# EAGLE design untitled (EAGLE 8.3.2)
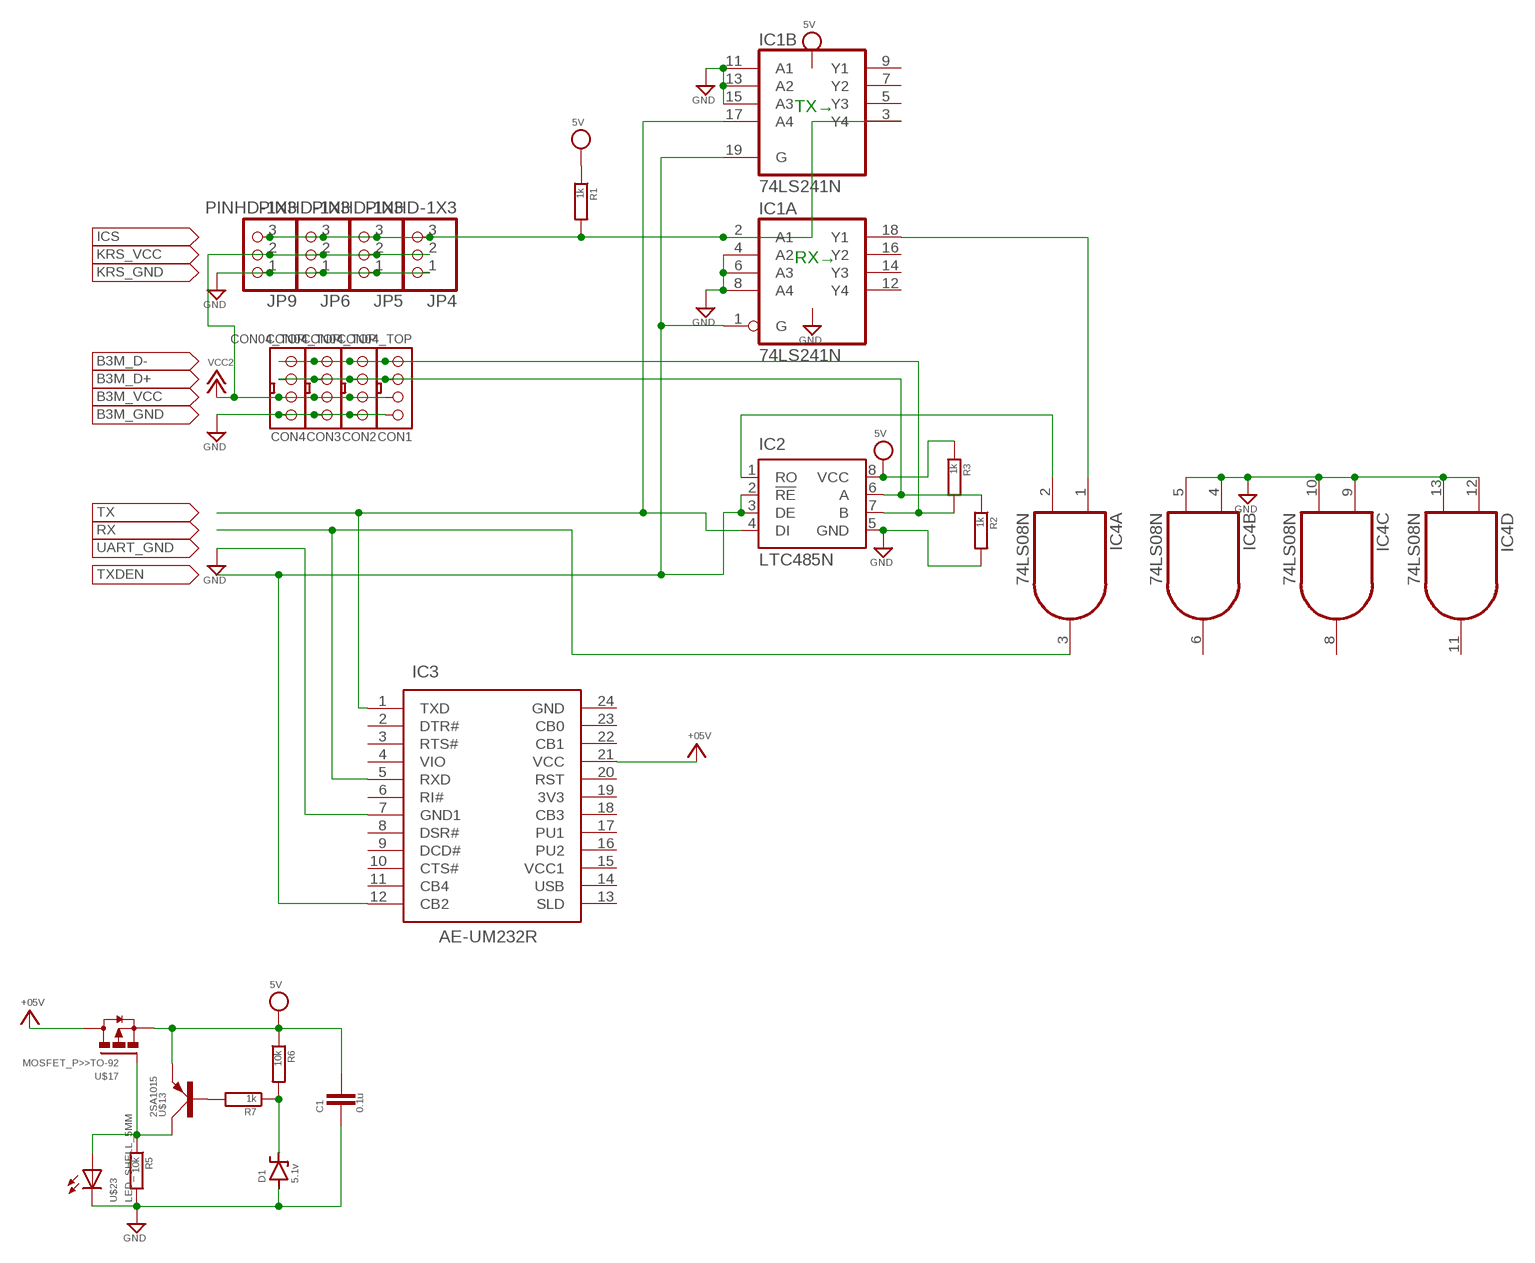
[diagram p0: schematic, sheet 1]

## Parts
C1  0.1u  C>>050-024X044  [C050-024X044]
CON1  CON04_TOP  [TOP_CON4]
CON2  CON04_TOP  [TOP_CON4]
CON3  CON04_TOP  [TOP_CON4]
CON4  CON04_TOP  [TOP_CON4]
D1  5.1v  ZENER-DIODE>>ZD-5  [ZDIO-5]
IC1  74LS241N  [DIL20]
IC2  LTC485N  [DIL08]
IC3  AE-UM232R  [AE-UM232R]
IC4  74LS08N  [DIL14]
JP4  PINHD-1X3  [1X03]
JP5  PINHD-1X3  [1X03]
JP6  PINHD-1X3  [1X03]
JP9  PINHD-1X3  [1X03]
R1  1k  R-EU>>1/4W(8MM)  [1/4W(8MM)]
R2  1k  R-EU>>1/4W(8MM)  [1/4W(8MM)]
R3  1k  R-EU>>1/4W(8MM)  [1/4W(8MM)]
R5  10k  R-EU>>1/4W(8MM)  [1/4W(8MM)]
R6  10k  R-EU>>1/4W(8MM)  [1/4W(8MM)]
R7  1k  R-EU>>1/4W(8MM)  [1/4W(8MM)]
U$13  2SA1015  TR_PNP>>TO-92  [TO-92]
U$17  MOSFET_P>>TO-92  [TO-92]
U$23  LED_SHELL_5MM  [5MM]

## Nets
+5V: IC3.21(VCC) U$17.2(D) ; supply symbol labelled +05V
GND: C1.2 CON1.P$1 CON2.P$1 CON3.P$1 CON4.P$1 D1.A IC1.4(A:A2) IC1.6(A:A3) IC1.8(A:A4) IC1.11(B:A1) IC1.13(B:A2) IC1.15(B:A3) IC2.5(GND) IC3.7(GND1) IC4.4(B:I0) IC4.5(B:I1) IC4.9(C:I0) IC4.10(C:I1) IC4.12(D:I0) IC4.13(D:I1) JP4.1 JP5.1 JP6.1 JP9.1 R2.2 R5.2 U$23.P$2(C)
ICS: IC1.2(A:A1) IC1.3(B:Y4) JP4.3 JP5.3 JP6.3 JP9.3 R1.2
N$1: IC1.18(A:Y1) IC4.1(A:I0)
N$5: CON1.P$3 CON2.P$3 CON3.P$3 CON4.P$3 IC2.6(A) R2.1
N$7: IC2.1(RO) IC4.2(A:I1)
N$9: R5.1 U$13.2(C) U$17.1(G) U$23.P$1(A)
N$10: D1.C R6.2 R7.1
N$11: R7.2 U$13.3(B)
N$12: CON1.P$4 CON2.P$4 CON3.P$4 CON4.P$4 IC2.7(B) R3.2
RXD: IC3.5(RXD) IC4.3(A:O)
TXD: IC1.17(B:A4) IC2.4(DI) IC3.1(TXD)
TXDEN: IC1.1(A:G) IC1.19(B:G) IC2.2(!RE) IC2.3(DE) IC3.12(CB2)
VCC: C1.1 IC2.8(VCC) R1.1 R3.1 R6.1 U$13.1(E) U$17.3(S) ; supply symbol labelled 5V
VCC2: CON1.P$2 CON2.P$2 CON3.P$2 CON4.P$2 JP4.2 JP5.2 JP6.2 JP9.2
Unconnected: IC1.5(B:Y3) IC1.7(B:Y2) IC1.9(B:Y1) IC1.12(A:Y4) IC1.14(A:Y3) IC1.16(A:Y2) IC3.2(DTR#) IC3.3(RTS#) IC3.4(VIO) IC3.6(RI#) IC3.8(DSR#) IC3.9(DCD#) IC3.10(CTS#) IC3.11(CB4) IC3.13(SLD) IC3.14(USB) IC3.16(PU2) IC3.17(PU1) IC3.18(CB3) IC3.19(3V3) IC3.20(RST) IC3.22(CB1) IC3.23(CB0) IC4.6(B:O) IC4.8(C:O) IC4.11(D:O)

## Notes on the sheet
- TX→
- RX→

## Power pins joined to a net without a drawn wire
GND: IC1.10(P:GND) IC3.24(GND) IC4.7(P:GND)
VCC: IC1.20(P:VCC) IC4.14(P:VCC)
VCC1: IC3.15(VCC1)

## Library data of the parts
C1 = !Capasiter:C>>: CAPACITOR, European symbol
CON1-CON4 = !con_XH(XHｺﾈｸﾀ):CON04_: Low insertion connector 4pin
D1 = !diode(ﾀﾞｲｵｰﾄﾞ):ZENER-DIODE>>: Z-Diode
IC1 = 74xx-us:74*241: Octal BUFFER and LINE DRIVER, 3-state
IC2 = linear-technology:LTC485: Low Power RS485 Interface Transceiver Source: http://www.linear.com/pc/downloadDocument.do?navId=H0,C1,C1007,C1017,P2064,D1718; OC_FARNELL: unknown; OC_NEWARK: unknown
IC3 = !usb-usart:AE-UM232R: FT232RL USB-Serial Converter - AE-UM232R
IC4 = 74xx-us:74*08: Quad 2-input AND gate
JP4-JP6 JP9 = !pinhead(ﾋﾟﾝﾍｯﾀﾞ):PINHD-1X3: PIN HEADER
R1-R3 R5-R7 = !Resistor(抵抗):R-EU>>: RESISTOR, European symbol
U$13 = !FET_transister_v-reg:TR_PNP>>
U$17 = !FET_transister_v-reg:MOSFET_P>>
U$23 = !led:LED_SHELL

## Board
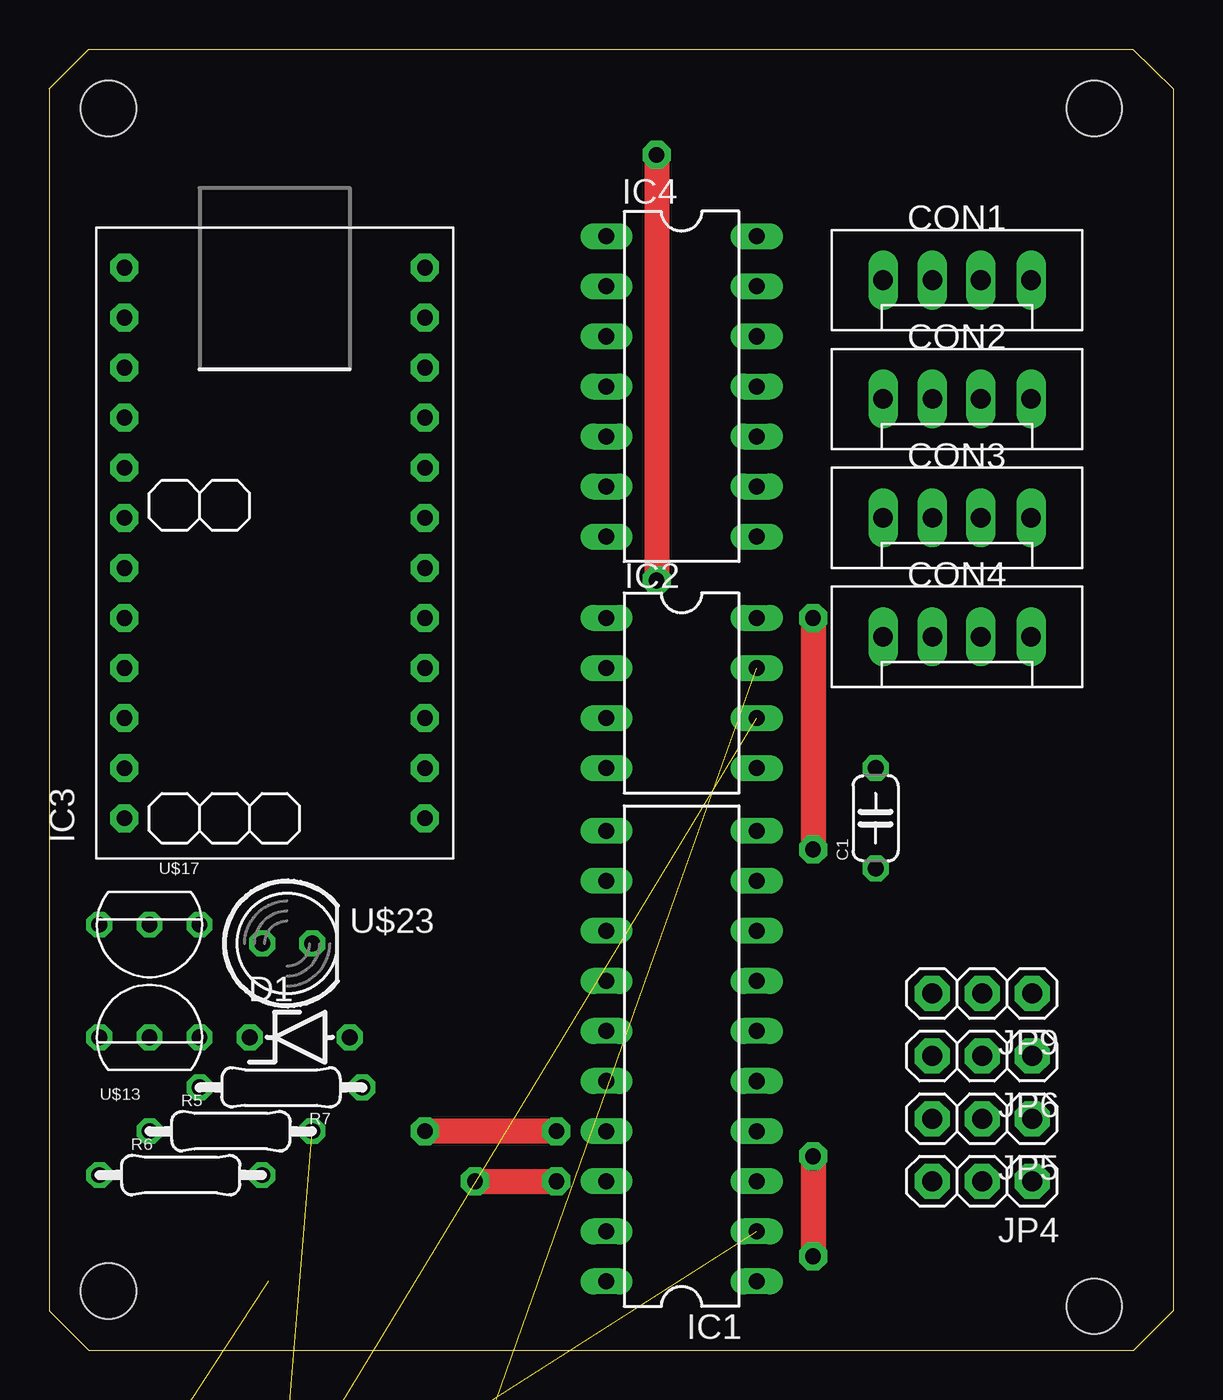
[diagram p1: board, top side]
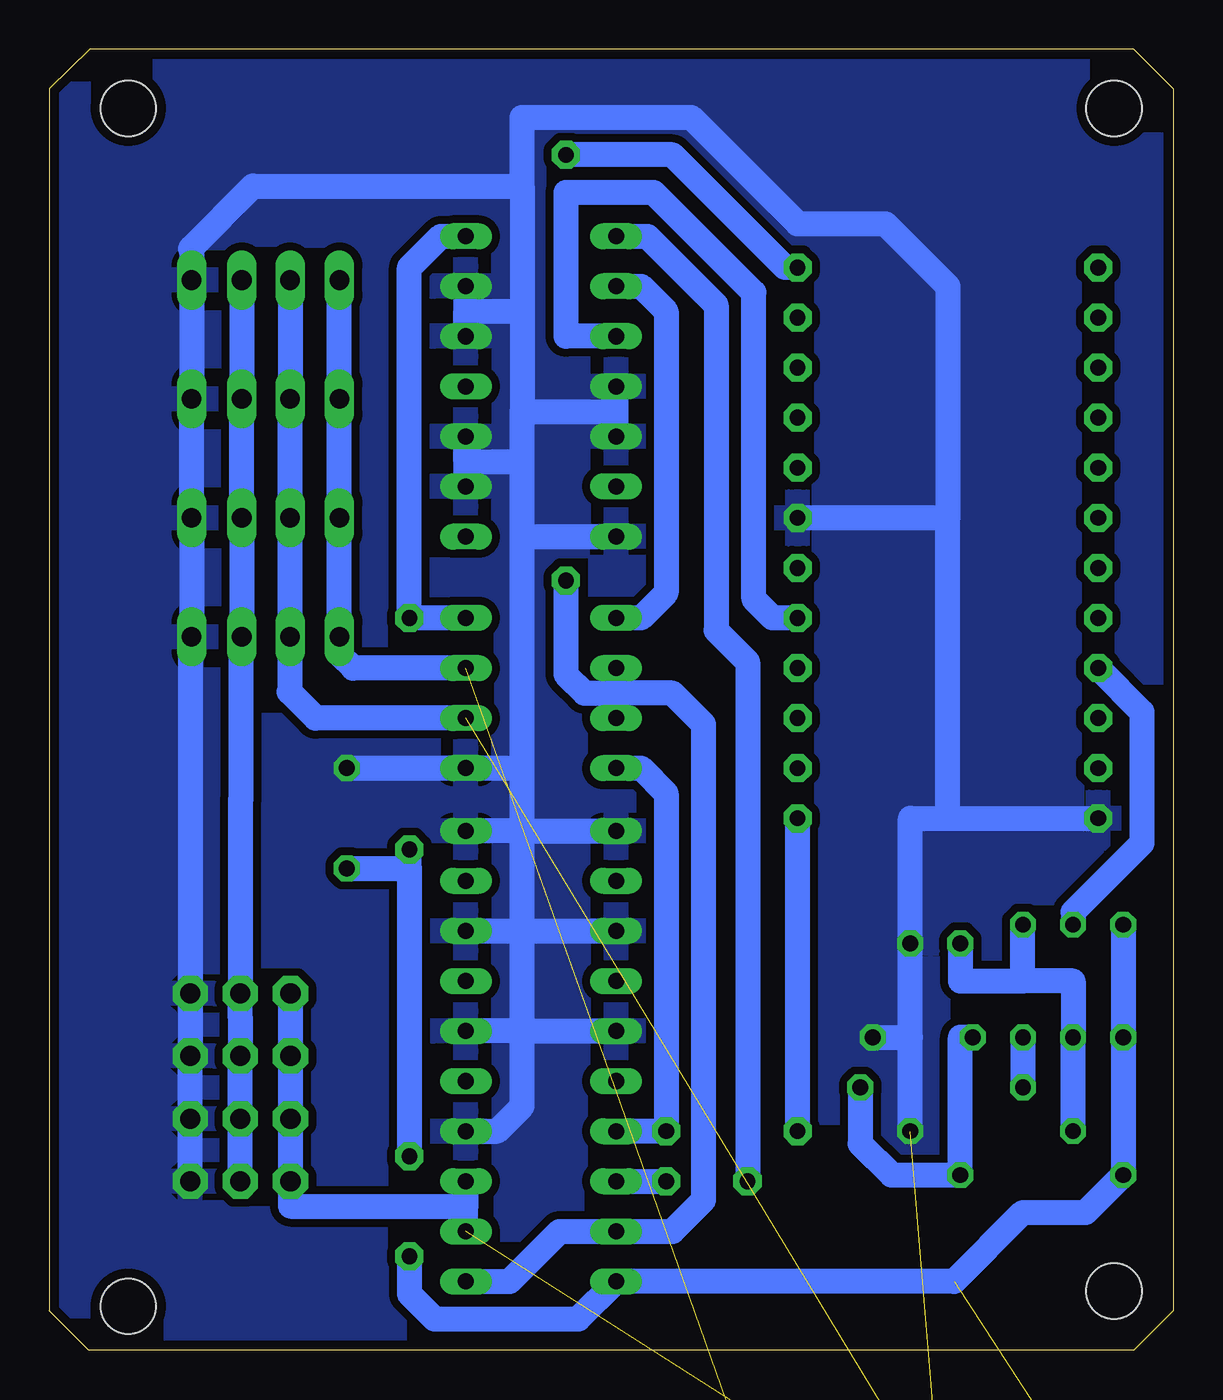
[diagram p2: board, bottom side, seen from below]

Size 57 x 66 mm. Coordinates in mm from the lower left corner, seen from the top.
Outline: 2,66 54.95,66 57,64 57,2 55,0 2,0 0,2 0,64 2,66
Copper layers (1*16): Top 0.035mm / dielectric 1.5mm / Bottom 0.035mm
Design rules "default *": minimum track width 24mil, minimum drill 0.8mm, track to track 8mil, track to pad 8mil, pad to pad 8mil, via to via 8mil, smd to smd 8mil, copper to edge 0.5mm, drill to drill 8mil, minimum pad ring 10mil, minimum via ring 8mil, stop-mask expansion 4mil, vias tented up to drill 0mil, thermal gap 10mil
Holes 2.8 mm at 3,3 53,2.22 3,63 53,63

### Footprints (pad centres in the part's own frame; a part is rotated, then mirrored left to right if it is on the bottom)
C050-024X044 = drill 0.813 octagon: 1 -2.54,0; 2 2.54,0
TOP_CON4 = drill 1 long: P$1 3.75,0; P$2 1.2,0; P$3 -1.25,0; P$4 -3.75,0
ZDIO-5 = drill 0.813 octagon: A 2.54,0; C -2.54,0
DIL20 = drill 0.813 long: 1 -11.43,-3.81; 2 -8.89,-3.81; 3 -6.35,-3.81; 4 -3.81,-3.81; 5 -1.27,-3.81; 6 1.27,-3.81; 7 3.81,-3.81; 8 6.35,-3.81; 9 8.89,-3.81; 10 11.43,-3.81; 11 11.43,3.81; 12 8.89,3.81; 13 6.35,3.81; 14 3.81,3.81; 15 1.27,3.81; 16 -1.27,3.81; 17 -3.81,3.81; 18 -6.35,3.81; 19 -8.89,3.81; 20 -11.43,3.81
DIL08 = drill 0.813 long: 1 -3.81,-3.81; 2 -1.27,-3.81; 3 1.27,-3.81; 4 3.81,-3.81; 5 3.81,3.81; 6 1.27,3.81; 7 -1.27,3.81; 8 -3.81,3.81
AE-UM232R = drill 0.8 pad 1.422 octagon: 1 -13.97,-7.62; 2 -11.43,-7.62; 3 -8.89,-7.62; 4 -6.35,-7.62; 5 -3.81,-7.62; 6 -1.27,-7.62; 7 1.27,-7.62; 8 3.81,-7.62; 9 6.35,-7.62; 10 8.89,-7.62; 11 11.43,-7.62; 12 13.97,-7.62; 13 13.97,7.62; 14 11.43,7.62; 15 8.89,7.62; 16 6.35,7.62; 17 3.81,7.62; 18 1.27,7.62; 19 -1.27,7.62; 20 -3.81,7.62; 21 -6.35,7.62; 22 -8.89,7.62; 23 -11.43,7.62; 24 -13.97,7.62
DIL14 = drill 0.813 long: 1 -7.62,-3.81; 2 -5.08,-3.81; 3 -2.54,-3.81; 4 0,-3.81; 5 2.54,-3.81; 6 5.08,-3.81; 7 7.62,-3.81; 8 7.62,3.81; 9 5.08,3.81; 10 2.54,3.81; 11 0,3.81; 12 -2.54,3.81; 13 -5.08,3.81; 14 -7.62,3.81
1X03 = drill 1.016 pad 1.778 octagon: 1 -2.54,0; 2 0,0; 3 2.54,0
1/4W(8MM) = drill 0.8 pad 1.27 octagon: 1 -4.128,0; 2 4.128,0
TO-92 = drill 0.8 octagon: 1 -2.54,0; 2 0,0; 3 2.54,0
5MM = drill 0.813 octagon: P$1 -1.27,0; P$2 1.27,0

### Placement (x,y rotation side)
C1  41.91,26.99 90 top
CON1  46.04,54.29 0 top
CON2  46.04,48.26 0 top
CON3  46.04,42.23 0 top
CON4  46.04,36.2 0 top
D1  12.7,15.88 0 top
IC1  32.07,14.92 90 top
IC2  32.07,33.34 270 top
IC3  11.43,40.96 90 top
IC4  32.07,48.9 270 top
JP4  47.31,8.57 180 top
JP5  47.31,11.75 180 top
JP6  47.31,14.92 180 top
JP9  47.31,18.1 180 top
R1  6.35,-10.16 0 top  (outside the outline)
R2  6.35,-23.5 0 top  (outside the outline)
R3  6.35,-36.83 0 top  (outside the outline)
R5  9.21,11.11 0 top
R6  6.67,8.89 0 top
R7  11.75,13.34 180 top
U$13  5.08,15.88 0 top
U$17  5.08,21.59 180 top
U$23  12.06,20.64 0 top

### Tracks (layer width: path | path; a pad name or v marks a point on that pad's centre or on a via)
+5V
  Bottom 1.27: U$17.2 5.08,22.23 1.59,25.72 1.59,32.38 IC3.21
GND  (1 unrouted)
  Bottom 1.27: 13.34,15.88 U$23.P$2 13.34,26.99 11.43,26.99 | R5.2 13.34,15.88 | D1.A 13.34,15.88 | IC4.5 28.26,47.62 | 28.26,47.62 IC4.4 | 35.88,45.09 IC4.9 | 35.88,45.09 IC4.10 | IC4.13 IC4.12 35.88,52.7 33.02,52.7 | 33.02,47.62 28.26,47.62 | 33.02,41.27 IC4.7 | 33.02,45.09 33.02,47.62 | 35.88,45.09 33.02,45.09 | 33.02,26.35 IC1.11 | 33.02,26.35 IC1.10 | IC1.8 33.02,21.27 | 33.02,21.27 IC1.13 | 33.02,16.19 IC1.15 | 33.02,16.19 IC1.6 | 33.02,16.19 33.02,21.27 | 33.02,21.27 33.02,26.35 | 33.02,29.53 IC2.5 C1.2 | 33.02,29.53 33.02,41.27 | 33.02,41.27 33.02,45.09 | 33.02,26.35 33.02,29.53 | 11.43,42.23 IC3.7 | 11.43,26.99 11.43,42.23 | 11.43,26.99 IC3.24 | 33.02,52.7 33.02,47.62 | 33.02,59.05 33.02,52.7 | 33.02,59.05 33.02,62.55 24.45,62.55 19.05,57.15 14.61,57.15 11.43,53.98 11.43,42.23 | JP4.1 JP5.1 JP6.1 JP9.1 49.85,36.13 CON4.P$1 CON3.P$1 CON2.P$1 CON1.P$1 49.79,55.94 | 34.92,11.11 IC1.4 34.29,11.11 33.02,12.38 33.02,16.19 | 49.85,55.88 49.79,55.94 | 49.79,55.94 46.67,59.05 33.02,59.05
  pour Bottom (isolate 0.406): -3.81,69.22 61.59,69.22 61.59,-2.86 -3.81,-2.86
ICS  (1 unrouted)
  Bottom 1.27: IC1.2 IC1.3 35.88,7.3 44.77,7.3 JP4.3 JP5.3 JP6.3 JP9.3
N$1  (via drill 0.8 pad 1.42)
  Top 1.27: v21.59,8.57 v25.72,8.57
  Bottom 1.27: IC1.18 v25.72,8.57 | IC4.1 26.67,56.52 23.18,53.02 23.18,36.51 21.59,34.92 v21.59,8.57
N$5  (1 unrouted)
  Bottom 1.27: IC2.6 43.5,32.07 44.79,33.36 | 44.79,33.36 44.84,33.41 | CON1.P$3 CON2.P$3 CON3.P$3 CON4.P$3 44.79,33.36
N$7
  Bottom 1.27: IC4.2 26.99,53.98 25.72,52.7 25.72,38.42 26.99,37.15 IC2.1
N$9
  Bottom 1.27: R5.1 U$13.2 5.08,18.73 7.62,18.73 | 7.62,18.73 U$17.1 | U$23.P$1 10.79,18.73 7.62,18.73
N$10
  Bottom 1.27: D1.C 10.79,15.88 R6.2 14.29,8.89 15.88,10.48 R7.1
N$11
  Bottom 1.27: U$13.3 R7.2
N$12  (1 unrouted)
  Bottom 1.27: CON1.P$4 CON2.P$4 CON3.P$4 CON4.P$4 42.29,35.3 41.59,34.61 IC2.7
RXD
  Bottom 1.27: IC4.3 30.8,51.44 30.8,58.74 26.35,58.74 21.27,53.66 21.27,38.1 20.32,37.15 IC3.5
TXD  (via drill 0.8 pad 1.42)
  Top 1.27: v25.72,11.11 v19.05,11.11
  Bottom 1.27: IC2.4 26.99,29.53 25.72,28.26 v25.72,11.11 IC1.17 | v19.05,11.11 IC3.1
TXDEN  (via drill 0.8 pad 1.42)
  Top 1.27: v30.8,60.64 v30.8,39.05
  Bottom 1.27: 28.26,33.34 IC2.2 | 28.26,33.34 25.4,33.34 23.81,31.75 23.81,7.62 25.4,6.03 IC1.19 31.11,6.03 33.66,3.49 IC1.1 | 28.26,33.34 IC2.3 | IC3.12 19.68,54.93 25.4,60.64 v30.8,60.64 | v30.8,39.05 30.8,34.29 29.84,33.34 28.26,33.34
VCC  (via drill 0.8 pad 1.42)  (2 unrouted)
  Top 1.27: v38.73,37.15 v38.73,25.4 | v38.73,9.84 v38.73,4.76
  Bottom 1.27: U$17.3 U$13.1 R6.1 4.45,6.99 7.62,6.99 11.11,3.49 IC1.20 30.16,1.59 37.47,1.59 38.73,2.86 v38.73,4.76 | IC4.14 37.15,56.52 38.73,54.93 v38.73,37.15 IC2.8 | 38.73,24.45 v38.73,9.84 | 38.73,24.45 v38.73,25.4 | C1.1 38.73,24.45
VCC2
  Bottom 1.27: CON1.P$2 CON2.P$2 CON3.P$2 CON4.P$2 47.29,36.15 47.29,27.96 47.31,27.94 JP9.2 47.31,16.83 JP6.2 JP5.2 JP4.2